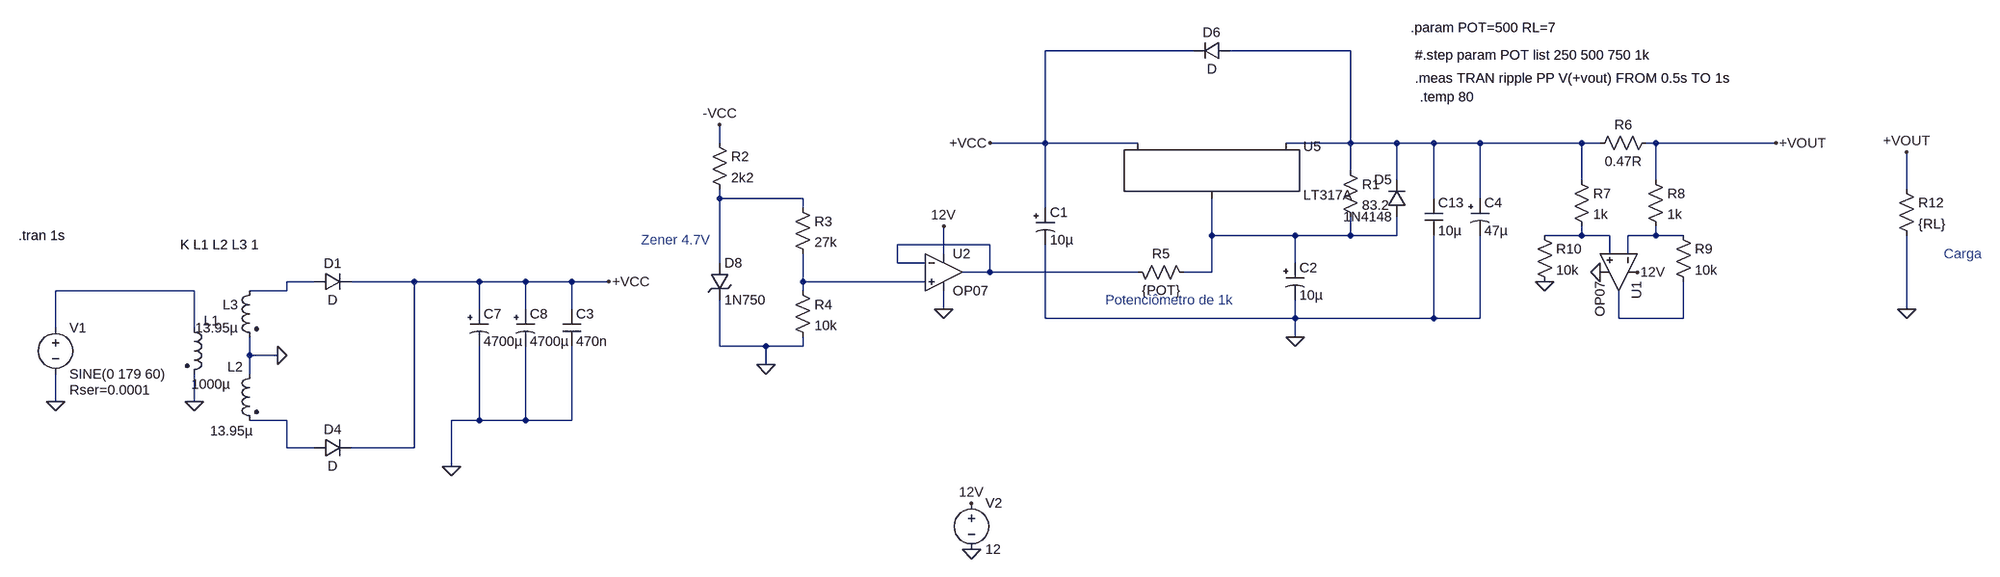
[diagram p0: schematic Fonte_Simetrica.asc]
Fonte_Simetrica.asc, the LTspice schematic file:
Version 4
SHEET 1 3172 852
WIRE 1744 -1104 1488 -1104
WIRE 2016 -1104 1808 -1104
WIRE 896 -944 896 -976
WIRE 1488 -944 1488 -1104
WIRE 1488 -944 1392 -944
WIRE 1648 -944 1488 -944
WIRE 2016 -944 2016 -1104
WIRE 2016 -944 1904 -944
WIRE 2096 -944 2016 -944
WIRE 2160 -944 2096 -944
WIRE 2240 -944 2160 -944
WIRE 2416 -944 2240 -944
WIRE 2448 -944 2416 -944
WIRE 2544 -944 2528 -944
WIRE 2752 -944 2544 -944
WIRE 2016 -896 2016 -944
WIRE 2096 -880 2096 -944
WIRE 2416 -880 2416 -944
WIRE 2544 -880 2544 -944
WIRE 3040 -864 3040 -928
WIRE 896 -848 896 -864
WIRE 1040 -848 896 -848
WIRE 2160 -848 2160 -944
WIRE 2240 -848 2240 -944
WIRE 1040 -832 1040 -848
WIRE 1488 -832 1488 -944
WIRE 1776 -784 1776 -848
WIRE 1920 -784 1776 -784
WIRE 2016 -784 2016 -816
WIRE 2016 -784 1920 -784
WIRE 2096 -784 2096 -816
WIRE 2096 -784 2016 -784
WIRE 2416 -784 2416 -800
WIRE 2416 -784 2352 -784
WIRE 2464 -784 2416 -784
WIRE 2544 -784 2544 -800
WIRE 2544 -784 2496 -784
WIRE 2592 -784 2544 -784
WIRE 1392 -768 1232 -768
WIRE 1312 -752 1312 -800
WIRE 2464 -752 2464 -784
WIRE 2496 -752 2496 -784
WIRE 896 -736 896 -848
WIRE 1232 -736 1232 -768
WIRE 1280 -736 1232 -736
WIRE 1920 -736 1920 -784
WIRE 1392 -720 1392 -768
WIRE 1392 -720 1344 -720
WIRE 1648 -720 1392 -720
WIRE 1776 -720 1776 -784
WIRE 1776 -720 1728 -720
WIRE 128 -704 80 -704
WIRE 368 -704 192 -704
WIRE 480 -704 368 -704
WIRE 560 -704 480 -704
WIRE 640 -704 560 -704
WIRE 704 -704 640 -704
WIRE 1040 -704 1040 -752
WIRE 1280 -704 1040 -704
WIRE -80 -688 -320 -688
WIRE 80 -688 80 -704
WIRE 80 -688 16 -688
WIRE 1040 -688 1040 -704
WIRE 480 -656 480 -704
WIRE 560 -656 560 -704
WIRE 640 -656 640 -704
WIRE 1312 -656 1312 -688
WIRE 3040 -656 3040 -784
WIRE 1488 -640 1488 -768
WIRE 1920 -640 1920 -672
WIRE 1920 -640 1488 -640
WIRE 2160 -640 2160 -784
WIRE 2160 -640 1920 -640
WIRE 2240 -640 2240 -784
WIRE 2240 -640 2160 -640
WIRE 2480 -640 2480 -688
WIRE 2592 -640 2592 -704
WIRE 2592 -640 2480 -640
WIRE -320 -624 -320 -688
WIRE -80 -624 -80 -688
WIRE 1920 -608 1920 -640
WIRE 896 -592 896 -672
WIRE 976 -592 896 -592
WIRE 1040 -592 1040 -608
WIRE 1040 -592 976 -592
WIRE 16 -576 16 -608
WIRE 64 -576 16 -576
WIRE 976 -560 976 -592
WIRE 16 -544 16 -576
WIRE -320 -496 -320 -544
WIRE -80 -496 -80 -544
WIRE 80 -464 16 -464
WIRE 480 -464 480 -592
WIRE 480 -464 432 -464
WIRE 560 -464 560 -592
WIRE 560 -464 480 -464
WIRE 640 -464 640 -592
WIRE 640 -464 560 -464
WIRE 80 -416 80 -464
WIRE 128 -416 80 -416
WIRE 368 -416 368 -704
WIRE 368 -416 192 -416
WIRE 432 -384 432 -464
FLAG -320 -496 0
FLAG -80 -496 0
FLAG 64 -576 0
FLAG 432 -384 0
FLAG 1920 -608 0
FLAG 976 -560 0
FLAG 704 -704 +VCC
FLAG 1392 -944 +VCC
FLAG 1312 -800 12V
FLAG 896 -976 -VCC
FLAG 2752 -944 +VOUT
FLAG 3040 -928 +VOUT
FLAG 3040 -656 0
FLAG 1360 -240 0
FLAG 1360 -320 12V
FLAG 1312 -656 0
FLAG 2448 -720 0
FLAG 2512 -720 12V
FLAG 2352 -704 0
SYMBOL ind2 -96 -640 R0
WINDOW 0 33 4 Left 2
WINDOW 3 11 114 Left 2
SYMATTR InstName L1
SYMATTR Value 1000µ
SYMATTR Type ind
SYMBOL ind2 32 -560 M0
WINDOW 0 27 4 Left 2
WINDOW 3 10 115 Left 2
SYMATTR InstName L2
SYMATTR Value 13.95µ
SYMATTR Type ind
SYMBOL voltage -320 -640 R0
WINDOW 123 0 0 Left 0
WINDOW 39 24 124 Left 2
SYMATTR SpiceLine Rser=0.0001
SYMATTR InstName V1
SYMATTR Value SINE(0 179 60)
SYMBOL ind2 32 -704 M0
SYMATTR InstName L3
SYMATTR Value 13.95µ
SYMATTR Type ind
SYMBOL diode 128 -688 R270
WINDOW 0 32 32 VTop 2
WINDOW 3 0 32 VBottom 2
SYMATTR InstName D1
SYMBOL diode 128 -400 R270
WINDOW 0 32 32 VTop 2
WINDOW 3 0 32 VBottom 2
SYMATTR InstName D4
SYMBOL cap 624 -656 R0
SYMATTR InstName C3
SYMATTR Value 470n
SYMBOL res 2000 -912 R0
SYMATTR InstName R1
SYMATTR Value 83.2
SYMBOL polcap 464 -656 R0
SYMATTR InstName C7
SYMATTR Value 4700µ
SYMATTR SpiceLine Rser=1
SYMBOL polcap 544 -656 R0
SYMATTR InstName C8
SYMATTR Value 4700µ
SYMATTR SpiceLine Rser=1
SYMBOL res 1744 -704 M270
WINDOW 0 32 56 VTop 2
WINDOW 3 0 56 VBottom 2
SYMATTR InstName R5
SYMATTR Value {POT}
SYMBOL polcap 1472 -832 R0
SYMATTR InstName C1
SYMATTR Value 10µ
SYMBOL polcap 1904 -736 R0
SYMATTR InstName C2
SYMATTR Value 10µ
SYMATTR SpiceLine Rser=10
SYMBOL polcap 2224 -848 R0
SYMATTR InstName C4
SYMATTR Value 47µ
SYMATTR SpiceLine Rser=10
SYMBOL diode 2112 -816 R180
WINDOW 0 24 64 Left 2
WINDOW 3 24 0 Left 2
SYMATTR InstName D5
SYMATTR Value 1N4148
SYMBOL res 880 -960 R0
SYMATTR InstName R2
SYMATTR Value 2k2
SYMBOL zener 880 -736 R0
SYMATTR InstName D8
SYMATTR Value 1N750
SYMBOL res 1024 -848 R0
SYMATTR InstName R3
SYMATTR Value 27k
SYMBOL res 1024 -704 R0
SYMATTR InstName R4
SYMATTR Value 10k
SYMBOL Opamps\\OP07 1312 -784 R0
SYMATTR InstName U2
SYMBOL diode 1808 -1120 R90
WINDOW 0 0 32 VBottom 2
WINDOW 3 32 32 VTop 2
SYMATTR InstName D6
SYMBOL PowerProducts\\LT317A 1776 -944 R0
SYMATTR InstName U5
SYMBOL cap 2144 -848 R0
SYMATTR InstName C13
SYMATTR Value 10µ
SYMATTR SpiceLine Rser=0.01
SYMBOL res 3024 -880 R0
SYMATTR InstName R12
SYMATTR Value {RL}
SYMBOL res 2544 -960 R90
WINDOW 0 0 56 VBottom 2
WINDOW 3 32 56 VTop 2
SYMATTR InstName R6
SYMATTR Value 0.47R
SYMBOL Opamps\\OP07 2544 -720 R90
SYMATTR InstName U1
SYMBOL voltage 1360 -336 R0
WINDOW 123 0 0 Left 0
WINDOW 39 0 0 Left 0
SYMATTR InstName V2
SYMATTR Value 12
SYMBOL res 2400 -896 R0
SYMATTR InstName R7
SYMATTR Value 1k
SYMBOL res 2528 -896 R0
SYMATTR InstName R8
SYMATTR Value 1k
SYMBOL res 2576 -800 R0
SYMATTR InstName R9
SYMATTR Value 10k
SYMBOL res 2336 -800 R0
SYMATTR InstName R10
SYMATTR Value 10k
TEXT -104 -768 Left 2 !K L1 L2 L3 1
TEXT -384 -784 Left 2 !.tran 1s
TEXT 1592 -672 Left 2 ;Potenciômetro de 1k
TEXT 3104 -752 Left 2 ;Carga
TEXT 760 -776 Left 2 ;Zener 4.7V
TEXT 2120 -1144 Left 2 !.param POT=500 RL=7
TEXT 2128 -1096 Left 2 !#.step param POT list 250 500 750 1k
TEXT 2128 -1056 Left 2 !.meas TRAN ripple PP V(+vout) FROM 0.5s TO 1s
TEXT 2136 -1024 Left 2 !.temp 80

The netlist it stands for:
* Fonte_Simetrica.asc
L1 N009 0 1000µ
L2 0 N011 13.95µ
V1 N009 0 SINE(0 179 60) Rser=0.0001
L3 N007 0 13.95µ
D1 N007 +VCC D
D4 N011 +VCC D
C3 +VCC 0 470n
R1 N001 N003 83.2
C7 +VCC 0 4700µ Rser=1
C8 +VCC 0 4700µ Rser=1
R5 N003 N006 {POT}
C1 +VCC 0 10µ
C2 N003 0 10µ Rser=10
C4 N001 0 47µ Rser=10
D5 N003 N001 1N4148
R2 -VCC N002 2k2
D8 N002 0 1N750
R3 N002 N008 27k
R4 N008 0 10k
XU2 N008 N006 12V 0 N006 LT1001  ; OP07, pins In+ In- V+ V- OUT
D6 N001 +VCC D
XU5 N003 N001 +VCC LT317A
C13 N001 0 10µ Rser=0.01
R12 +VOUT 0 {RL}
R6 +VOUT N001 0.47R
XU1 N004 N005 12V 0 N010 LT1001  ; OP07, pins In+ In- V+ V- OUT
V2 12V 0 12
R7 N001 N004 1k
R8 +VOUT N005 1k
R9 N005 N010 10k
R10 N004 0 10k
.model D D
.lib standard.dio
K L1 L2 L3 1
.tran 1s
* Potenciômetro de 1k
* Carga
* Zener 4.7V
.param POT=500 RL=7
#.step param POT list 250 500 750 1k
.meas TRAN ripple PP V(+vout) FROM 0.5s TO 1s
.temp 80
.lib LTC.lib
.backanno
.end